# EAGLE design Teensy-Maxuino-Slave-A4988-stepper (EAGLE 6.4)
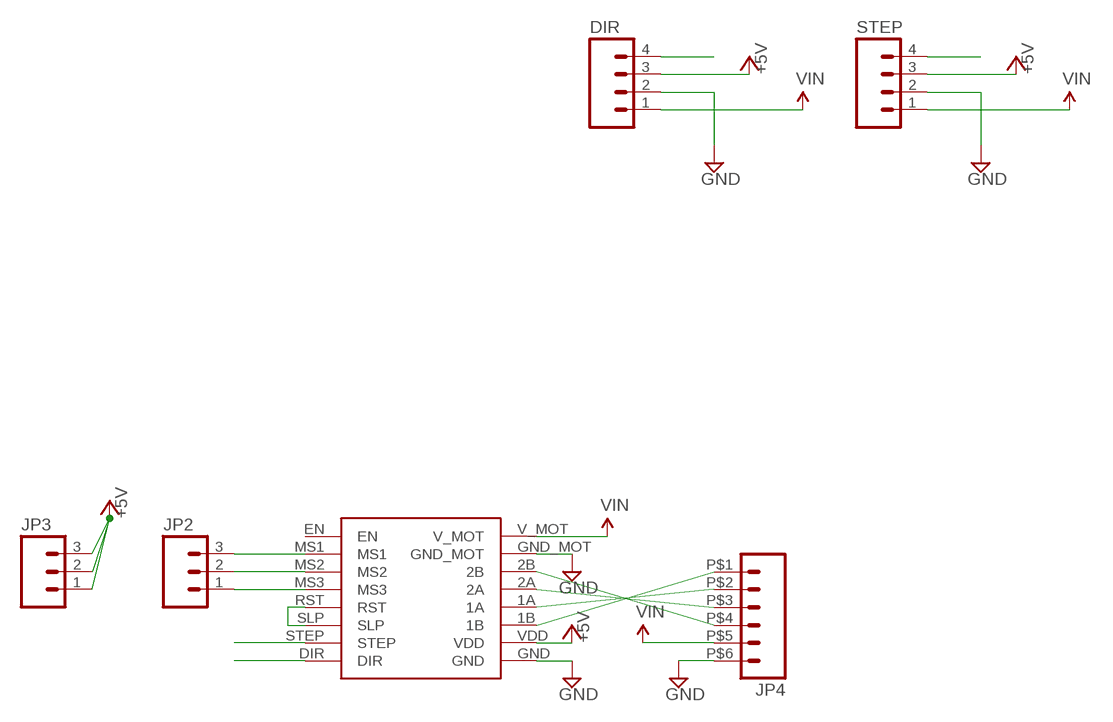
[diagram p0: schematic, sheet 1]

## Parts
DIR  M04PTH  [1X04]
JP2  M03PTH  [1X03]
JP3  M03PTH  [1X03]
JP4  M06  [SPRINGTERMINAL-2.54MM-6]
STEP  M04PTH  [1X04]
U$1  POLOLU_A4988  [POLOLU_A4988]

## Nets
+5V: DIR.3 JP3.1 JP3.2 JP3.3 STEP.3 U$1.VDD
DIR: DIR.4 U$1.DIR
GND: DIR.2 JP4.P$6 STEP.2 U$1.GND U$1.GND_MOT
N$1: JP4.P$4 U$1.2B
N$2: JP4.P$3 U$1.2A
N$3: JP4.P$2 U$1.1A
N$4: JP4.P$1 U$1.1B
N$6: U$1.RST U$1.SLP
N$8: JP2.3 U$1.MS1
N$9: JP2.2 U$1.MS2
N$10: JP2.1 U$1.MS3
STEP: STEP.4 U$1.STEP
VIN [Power]: DIR.1 JP4.P$5 STEP.1 U$1.V_MOT
Unconnected: U$1.EN

## Library data of the parts
DIR STEP = SparkFun-Connectors:M04: Header 4 Standard 4-pin 0.1" header. Use with straight break away headers (SKU : PRT-00116), right angle break away headers (PRT-00553), swiss pins (PRT-00743), machine pins (PRT-00117), and female headers (PRT-00115). Molex polarized connector foot print use with SKU : PRT-08231 with associated crimp pins and housings. 1MM SMD Version SKU: PRT-10208
JP2 JP3 = SparkFun-Connectors:M03: Header 3 Standard 3-pin 0.1" header. Use with straight break away headers (SKU : PRT-00116), right angle break away headers (PRT-00553), swiss pins (PRT-00743), machine pins (PRT-00117), and female headers (PRT-00115). Molex polarized connector foot print use with SKU : PRT-08232 with associated crimp pins and housings.
JP4 = aliEagleLib:M06: Header 6 Standard 6-pin 0.1" header. Use with straight break away headers (SKU : PRT-00116), right angle break away headers (PRT-00553), swiss pins (PRT-00743), machine pins (PRT-00117), and female headers (PRT-00115). Molex polarized connector foot print use with SKU : PRT-08094 with associated crimp pins and housings. NOTES ON THE VARIANTS LOCK and LOCK_LONGPADS... This footprint was designed to help hold the alignment of a through-hole component (i.e. 6-pin header) while soldering it into place. You may notice that each hole has been shifted either up or down by 0.005 of an inch from it's more standard position (which is a perfectly straight line). This slight alteration caused the pins (the squares in the middle) to touch the edges of the holes. Because they are alternating, it causes a "brace" to hold the component in place. 0.005 has proven to be the perfect amount of "off-center" position when using our standard breakaway headers. Although looks a little odd when you look at the bare footprint, once you have a header in there, the alteration is very hard to notice. Also, if you push a header all the way into place, it is covered up entirely on the bottom side. This idea of altering the position of holes to aid alignment will be further integrated into the Sparkfun Library for other footprints. It can help hold any component with 3 or more connection pins.
U$1 = aliEagleLib:POLOLU_A4988

## Net classes
0 default: width 0.152 mm, clearance 0.152 mm
1 GND: width 0.406 mm, clearance 0.152 mm
2 Power: width 0.406 mm, clearance 0.152 mm

## Board
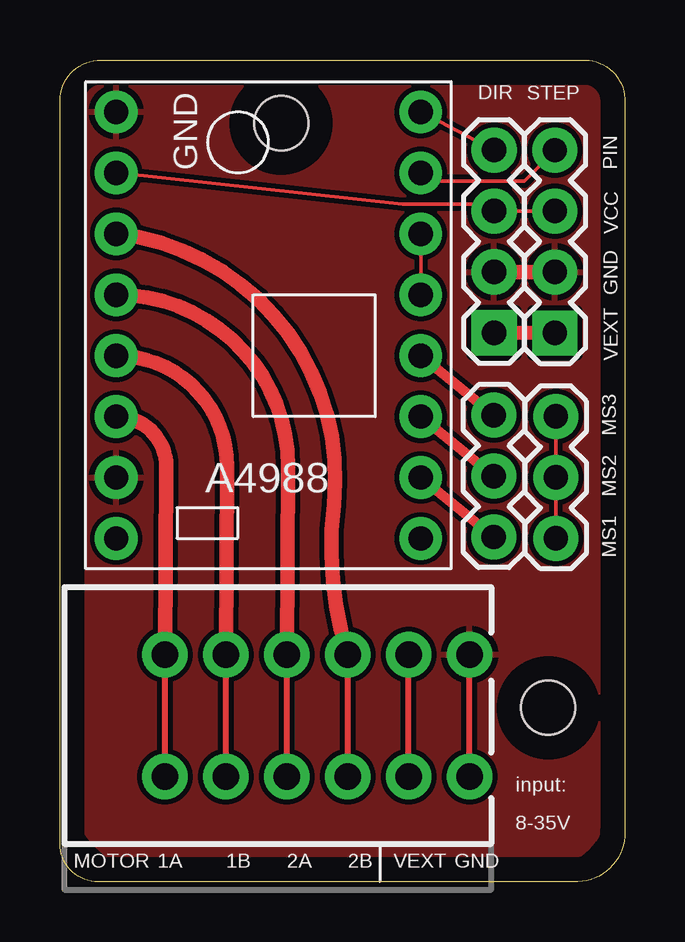
[diagram p1: board, top side]
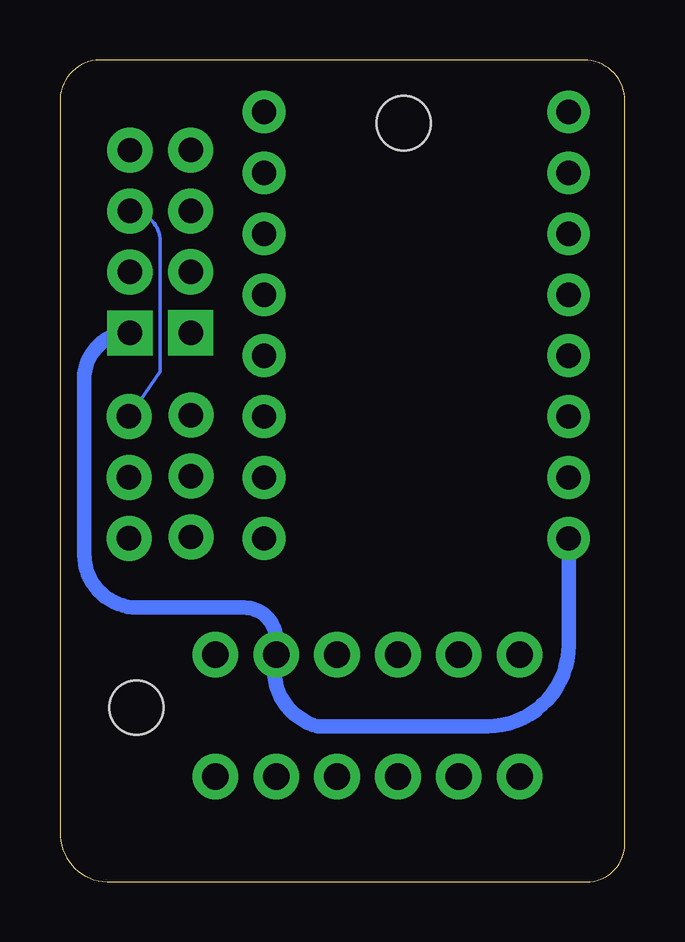
[diagram p2: board, bottom side, seen from below]

Size 23.55 x 34.26 mm. Coordinates in mm from the lower left corner, seen from the top.
Outline: 0,1.59 0,32.55 arc-90 1.71,34.26 21.75,34.26 arc-90 23.55,32.65 23.55,2.07 arc-90 21.59,0 1.59,0 arc-90 0,1.59
Copper layers (1*16): Top 0.035mm / dielectric 1.5mm / Bottom 0.035mm
Design rules "default *": minimum track width 6mil, minimum drill 24mil, track to track 8mil, track to pad 8mil, pad to pad 8mil, via to via 8mil, smd to smd 8mil, copper to edge 40mil, drill to drill 6mil, minimum pad ring 10mil, minimum via ring 8mil, stop-mask expansion 4mil, vias tented up to drill 0mil, thermal gap 10mil
Holes 2.26 mm at 9.23,31.62 20.36,7.26

### Footprints (pad centres in the part's own frame; a part is rotated, then mirrored left to right if it is on the bottom)
1X04 = drill 1.016 pad 1.88 square: 1 0,0 | drill 1.016 pad 1.88: 2 2.54,0; 3 5.08,0; 4 7.62,0
1X03 = drill 1.016 pad 1.88: 1 0,0; 2 2.54,0; 3 5.08,0
SPRINGTERMINAL-2.54MM-6 = drill 1.1 pad 1.9: 1 2.54,-2.54; 2 0,-2.54; 3 -2.54,-2.54; 4 -5.08,-2.54; 5 5.08,-2.54; 6 7.62,-2.54; P$1 2.54,2.54; P$2 0,2.54; P$3 -2.54,2.54; P$4 -5.08,2.54; P$5 5.08,2.54; P$6 7.62,2.54
POLOLU_A4988 = drill 1.016 pad 1.778: 1A 6.35,-1.27; 1B 6.35,-3.81; 2A 6.35,1.27; 2B 6.35,3.81; DIR -6.35,-8.89; EN -6.35,8.89; GND 6.35,-8.89; GND_MOT 6.35,6.35; MS1 -6.35,6.35; MS2 -6.35,3.81; MS3 -6.35,1.27; RST -6.35,-1.27; SLP -6.35,-3.81; STEP -6.35,-6.35; V_MOT 6.35,8.89; VDD 6.35,-6.35

### Placement (x,y rotation side)
DIR  18.1,22.88 90 top
JP2  18.09,19.45 270 top
JP3  20.68,19.4 270 top
JP4  9.46,6.93 0 top
STEP  20.64,22.88 90 top
U$1  8.69,23.2 180 top

### Tracks (layer width: path | path; a pad name or v marks a point on that pad's centre or on a via)
+5V
  Top 0.152: JP3.1 JP3.2 JP3.3 | U$1.VDD 14.29,28.26 17.46,28.26 DIR.3 STEP.3
  Bottom 0.152: STEP.3 arc90 19.38,26.7 19.38,21.28 JP3.1
DIR
  Top 0.152: DIR.4 U$1.DIR
GND
  Top 0.61: STEP.2 DIR.2 arc-90 DIR.2
  pour Top: 0.66,3.27 arc90 4.01,0.59 20.05,0.59 arc90 22.75,3.09 23.04,30.97 arc90 20.54,33.8 0.72,33.83
N$1
  Top 0.61: U$1.2B arc-90 4.43,17.3 JP4.P$4
N$2
  Top 0.61: U$1.2A arc-90 6.97,17.3 JP4.P$3
N$3
  Top 0.61: U$1.1A arc-90 9.51,17.3 JP4.P$2
N$4
  Top 0.61: U$1.1B arc-90 11.42,15.72 arc24 JP4.P$1
N$6
  Top 0.152: U$1.SLP U$1.RST
N$8
  Top 0.406: U$1.MS1 JP2.3
N$9
  Top 0.406: U$1.MS2 JP2.2
N$10
  Top 0.406: U$1.MS3 JP2.1
STEP
  Top 0.152: STEP.4 19.37,29.21 15.88,29.21 U$1.STEP
VIN
  Top 0.61: DIR.1 STEP.1
  Bottom 0.61: U$1.V_MOT 2.35,9.87 arc90 5.74,6.48 12.8,6.48 arc90 JP4.P$5 14.54,10.1 arc-90 15.88,11.43 20.32,11.43 arc90 22.54,13.65 22.54,20.98 arc90 STEP.1